# Altium project DCDC Buck Controller.PrjPcb
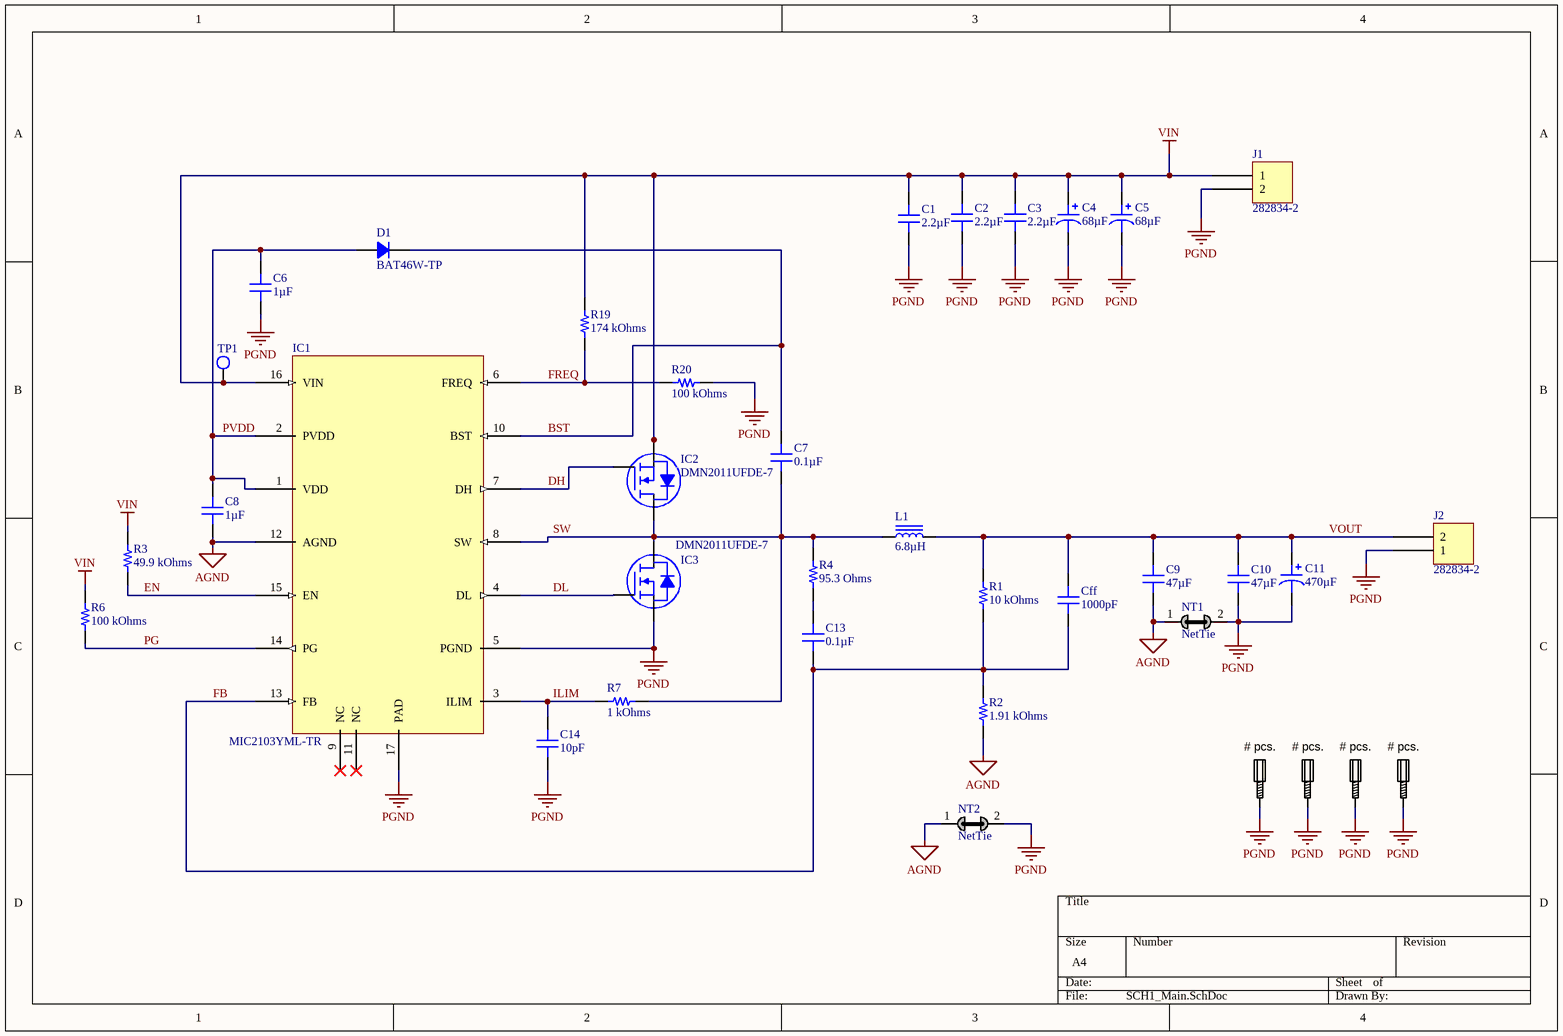
[diagram p0: SCH1_Main.SchDoc]
1 sheet, 36 parts. Net scope: global (net labels, ports and power ports of the same name join across sheets).
Board file: PCB1_DCDC_Controller.PcbDoc

## Sheet SCH1_Main.SchDoc
size A4

### Parts
C1  2.2µF  [CAP 0805_2012]
C2  2.2µF  [CAP 0805_2012]
C3  2.2µF  [CAP 0805_2012]
C4  68µF  [CAP ALSMD 6.6MM H6.1MM]
C5  68µF  [CAP ALSMD 6.6MM H6.1MM]
C6  1µF  [CAP 0805_2012]
C7  0.1µF  [CAP 0805_2012]
C8  1µF  [CAP 0805_2012]
C9  47µF  [CAP 1210_3225 - 2.8MM]
C10  47µF  [CAP 1210_3225 - 2.8MM]
C11  470µF  [CAP ALSMD 6.6MM H8.0MM]
C13  0.1µF  [CAP 0805_2012]
C14  10pF  [CAP 0805_2012]
Cff  1000pF  [CAP 0805_2012]
D1  BAT46W-TP  [SOD-123]
IC1  MIC2103YML-TR  [MLF-16_ML_4X4_00]
IC2  DMN2011UFDE-7  [DIODES U-DFN2020-6E]
IC3  DMN2011UFDE-7  [DIODES U-DFN2020-6E]
J1  282834-2  [TE 282834-2]
J2  282834-2  [TE 282834-2]
L1  6.8µH  [BOURNS SRR1280]
MECH1  # pcs.  [PCB_standoff]
MECH2  # pcs.  [PCB_standoff]
MECH3  # pcs.  [PCB_standoff]
MECH4  # pcs.  [PCB_standoff]
NT1  NetTie  [NetTie_Narrow2]  (net tie, no BOM)
NT2  NetTie  [NetTie_Narrow2]  (net tie, no BOM)
R1  10 kOhms  [RES 0805_2012]
R2  1.91 kOhms  [RES 0805_2012]
R3  49.9 kOhms  [RES 0805_2012]
R4  95.3 Ohms  [RES 0805_2012]
R6  100 kOhms  [RES 0805_2012]
R7  1 kOhms  [RES 0805_2012]
R19  174 kOhms  [RES 0805_2012]
R20  100 kOhms  [RES 0805_2012]
TP1  Test Point  [TestPoint-1.5mm]  (value not drawn)  (no BOM)

### Nets
AGND: C8.1 C9.1 IC1.12(AGND) NT1.1 NT2.1 R2.1
PGND: C1.1 C2.1 C3.1 C4.2 C5.2 C6.1 C10.1 C11.2 C14.1 IC1.5(PGND) IC1.17(PAD) IC3.S J1.2 J2.1 MECH1.MH1 MECH2.MH1 MECH3.MH1 MECH4.MH1 NT1.2 NT2.2 R20.1
VIN: C1.2 C2.2 C3.2 C4.1 C5.1 IC1.16(VIN) IC2.S J1.1 R3.2 R6.2 R19.2 TP1.1(TP)
BST: C7.2 D1.2 IC1.10(BST)
DH: IC1.7(DH) IC2.G
DL: IC1.4(DL) IC3.G
EN: IC1.15(EN) R3.1
FB: C13.1 Cff.1 IC1.13(FB) R1.1 R2.2
FREQ: IC1.6(FREQ) R19.1 R20.2
ILIM: C14.2 IC1.3(ILIM) R7.1
PG: IC1.14(PG) R6.1
PVDD: C6.2 C8.2 D1.1 IC1.1(VDD) IC1.2(PVDD)
SW: C7.1 IC1.8(SW) IC2.D(Drain) IC3.D(Drain) L1.1 R4.2 R7.2
VOUT: C9.2 C10.2 C11.1 Cff.2 J2.2 L1.2 R1.2
NetC13_2: C13.2 R4.1

Not connected (* = marked no-connect by the designer): IC1 9(NC)* 11(NC)*

### Library data of the parts
C1-C3 = 08053C225K4Z2A: CAP CER 2.2UF 25V X7R 0805; Manufacturer: AVX Corporation; Tolerance: ±10%; Part Number: 08053C225K4Z2A; Value: 2.2µF; Applications: Automotive, Boardflex Sensitive; Capacitance: 2.2µF; ComponentLink1Description: Datasheet; ComponentLink1URL: http://datasheets.avx.com/AutoMLCC.pdf; ComponentLink2Description: DigiKey Link; ComponentLink2URL: http://digikey.com/product-detail/en/avx-corporation/08053C225K4Z2A/478-12141-1-ND/9374710; Device Package: 0805 (2012 Metric); Features: Soft Termination; LastUpdated: 1/21/2020 12:02:42 AM; Lifecycle Status: Active; Minimum Order: 1; Mounting Type: Surface Mount, MLCC; Operating Temperature: -55°C ~ 125°C; Package / Case: 0805 (2012 Metric); Packaging: TapeAndReel; PartId: 16604; Part Status: Active; Price: 0.08; Ratings: AEC-Q200; Series: FLEXITERM®; Size / Dimension: 0.079" L x 0.049" W (2.01mm x 1.25mm); Supplier 1: DigiKey; Supplier Part Number 1: 478-12141-1-ND; Temperature Coefficient: X7R; Voltage - Rated: 25V
C4 C5 = UWD1E680MCL1GS: CAP ALUM 68UF 20% 25V SMD; Manufacturer: Nichicon; Impedance: 440 mOhms; Lifetime @ Temp.: 2000 Hrs @ 105°C; Ripple Current @ High Frequency: 230mA @ 100kHz; Ripple Current @ Low Frequency: 115mA @ 120Hz; Surface Mount Land Size: 0.260" L x 0.260" W (6.60mm x 6.60mm); Part Number: UWD1E680MCL1GS; Applications: General Purpose; Capacitance: 68µF; ComponentLink1Description: Datasheet; ComponentLink1URL: http://nichicon-us.com/english/products/pdfs/e-uwd.pdf; ComponentLink2Description: DigiKey Link; ComponentLink2URL: http://digikey.com/product-detail/en/nichicon/UWD1E680MCL1GS/493-9673-1-ND/3963005; Device Package: Radial, Can - SMD; Height - Seated (Max): 0.228" (5.80mm); LastUpdated: 1/21/2020 2:33:32 AM; Lifecycle Status: Active; Minimum Order: 1; Mounting Type: Surface Mount; Operating Temperature: -55°C ~ 105°C; Package / Case: Radial, Can - SMD; Packaging: TapeAndReel; PartId: 8861; Part Status: Active; Price: 0.22; Series: UWD; Size / Dimension: 0.248" Dia (6.30mm); Supplier 1: DigiKey; Supplier Part Number 1: 493-9673-1-ND; Tolerance: ±20%; Value: 68µF; Voltage - Rated: 25V
C6 C8 = CC0805KKX5R8BB105: CAP CER 1UF 25V X5R 0805; Manufacturer: Yageo; Tolerance: ±10%; Part Number: CC0805KKX5R8BB105; Value: 1µF; Applications: General Purpose; Capacitance: 1µF; ComponentLink1Description: Datasheet; ComponentLink1URL: https://www.yageo.com/upload/media/product/productsearch/datasheet/mlcc/UPY-GPHC_X5R_4V-to-50V_25.pdf; ComponentLink2Description: DigiKey Link; ComponentLink2URL: http://digikey.com/product-detail/en/yageo/CC0805KKX5R8BB105/311-1868-1-ND/5195770; Device Package: 0805 (2012 Metric); LastUpdated: 1/21/2020 12:03:00 AM; Lifecycle Status: Active; Minimum Order: 1; Mounting Type: Surface Mount, MLCC; Operating Temperature: -55°C ~ 85°C; Package / Case: 0805 (2012 Metric); Packaging: TapeAndReel; PartId: 6721; Part Status: Active; Price: 0.04; Series: CC; Size / Dimension: 0.079" L x 0.049" W (2.00mm x 1.25mm); Supplier 1: DigiKey; Supplier Part Number 1: 311-1868-1-ND; Temperature Coefficient: X5R; Thickness (Max): 0.057" (1.45mm); Voltage - Rated: 25V
C7 C13 = CL21B104KBFNNNE: CAP CER 0.1UF 50V X7R 0805; Manufacturer: Samsung Electro-Mechanics; Tolerance: ±10%; Part Number: CL21B104KBFNNNE; Value: 0.1µF; Applications: General Purpose; Capacitance: 0.1µF; ComponentLink1Description: Datasheet; ComponentLink1URL: http://www.samsungsem.com/kr/support/product-search/mlcc/CL21B104KBFNNNE.jsp; ComponentLink2Description: DigiKey Link; ComponentLink2URL: http://digikey.com/product-detail/en/samsung-electro-mechanics/CL21B104KBFNNNE/1276-1180-1-ND/3889266; Device Package: 0805 (2012 Metric); LastUpdated: 1/21/2020 12:03:00 AM; Lifecycle Status: Active; Minimum Order: 1; Mounting Type: Surface Mount, MLCC; Operating Temperature: -55°C ~ 125°C; Package / Case: 0805 (2012 Metric); Packaging: TapeAndReel; PartId: 6348; Part Status: Active; Price: 0.01; Series: CL; Size / Dimension: 0.079" L x 0.049" W (2.00mm x 1.25mm); Supplier 1: DigiKey; Supplier Part Number 1: 1276-1180-1-ND; Temperature Coefficient: X7R; Thickness (Max): 0.053" (1.35mm); Voltage - Rated: 50V
C9 C10 = GRM32ED71A476KE15L: CAP CER 47UF 10V X7T 1210; Manufacturer: Murata Electronics; Tolerance: ±10%; Part Number: GRM32ED71A476KE15L; Value: 47µF; Applications: General Purpose; Capacitance: 47µF; ComponentLink1Description: Datasheet; ComponentLink1URL: https://search.murata.co.jp/Ceramy/image/img/A01X/G101/ENG/GRM32ED71A476KE15-01.pdf; ComponentLink2Description: DigiKey Link; ComponentLink2URL: http://digikey.com/product-detail/en/murata-electronics/GRM32ED71A476KE15L/490-10532-1-ND/5026471; Device Package: 1210 (3225 Metric); LastUpdated: 8/13/2020 10:37:41 AM; Lifecycle Status: Active; Minimum Order: 1; Mounting Type: Surface Mount, MLCC; Operating Temperature: -55°C ~ 125°C; Package / Case: 1210 (3225 Metric); Packaging: TapeAndReel; PartId: 23810; Part Status: Active; Price: 0.36; Series: GRM; Size / Dimension: 0.126" L x 0.098" W (3.20mm x 2.50mm); Supplier 1: DigiKey; Supplier Part Number 1: 490-10532-1-ND; Temperature Coefficient: X7T; Thickness (Max): 0.106" (2.70mm)
C11 = EMZR100ARA471MF80G: CAP ALUM 470UF 20% 10V SMD; Manufacturer: United Chemi-Con; ESR (Equivalent Series Resistance): 160 mohm @ 100kHz; Lifetime @ Temp.: 2000 Hrs @ 105°C; Polarization: Polar; Ripple Current @ High Frequency: 600mA @ 100kHz; Ripple Current @ Low Frequency: 300mA @ 120Hz; Surface Mount Land Size: 0.260" L x 0.260" W (6.60mm x 6.60mm); Part Number: EMZR100ARA471MF80G; Applications: Automotive; Capacitance: 470µF; ComponentLink1Description: Datasheet; ComponentLink1URL: http://www.chemi-con.co.jp/cgi-bin/CAT_DB/SEARCH/cat_db_al.cgi?e=e&j=p&pdfname=mzr; ComponentLink2Description: DigiKey Link; ComponentLink2URL: http://digikey.com/product-detail/en/united-chemi-con/EMZR100ARA471MF80G/565-5133-1-ND/8637128; Device Package: Radial, Can - SMD; Height - Seated (Max): 0.315" (8.00mm); LastUpdated: 1/21/2020 4:06:45 AM; Lifecycle Status: Active; Minimum Order: 1; Mounting Type: Surface Mount; Operating Temperature: -55°C ~ 105°C; Package / Case: Radial, Can - SMD; Packaging: TapeAndReel; PartId: 8433; Part Status: Active; Price: 0.20; Ratings: AEC-Q200; Series: Alchip™- MZR; Size / Dimension: 0.248" Dia (6.30mm); Supplier 1: DigiKey; Supplier Part Number 1: 565-5133-1-ND; Tolerance: ±20%; Value: 470µF; Voltage - Rated: 10V
C14 = C0805C100J5GACTU: CAP CER 10PF 50V C0G/NP0 0805; Manufacturer: KEMET; Temperature Coefficient: C0G, NP0; Tolerance: ±5%; Part Number: C0805C100J5GACTU; Value: 10pF; Applications: General Purpose; Capacitance: 10pF; ComponentLink1Description: Datasheet; ComponentLink1URL: https://api.kemet.com/component-edge/download/datasheet/C0805C100J5GACTU.pdf; ComponentLink2Description: DigiKey Link; ComponentLink2URL: http://digikey.com/product-detail/en/kemet/C0805C100J5GACTU/399-1108-1-ND/411383; Device Package: 0805 (2012 Metric); Features: Low ESL; LastUpdated: 1/21/2020 12:02:51 AM; Lifecycle Status: Active; Minimum Order: 1; Mounting Type: Surface Mount, MLCC; Operating Temperature: -55°C ~ 125°C; Package / Case: 0805 (2012 Metric); Packaging: TapeAndReel; PartId: 12731; Part Status: Active; Price: 0.02; Series: SMD Comm C0G; Size / Dimension: 0.079" L x 0.049" W (2.00mm x 1.25mm); Supplier 1: DigiKey; Supplier Part Number 1: 399-1108-1-ND; Thickness (Max): 0.035" (0.88mm); Voltage - Rated: 50V
Cff = CC0805GRNPO9BN102: CAP CER 1000PF 50V NPO 0805; Manufacturer: Yageo; Temperature Coefficient: C0G, NP0; Tolerance: ±2%; Part Number: CC0805GRNPO9BN102; Value: 1000pF; Applications: General Purpose; Capacitance: 1000pF; ComponentLink1Description: Datasheet; ComponentLink1URL: https://www.yageo.com/upload/media/product/productsearch/datasheet/mlcc/UPY-GP_NP0_16V-to-50V_17.pdf; ComponentLink2Description: DigiKey Link; ComponentLink2URL: http://digikey.com/product-detail/en/yageo/CC0805GRNPO9BN102/311-4189-1-ND/8025278; Device Package: 0805 (2012 Metric); LastUpdated: 1/21/2020 12:02:57 AM; Lifecycle Status: Active; Minimum Order: 1; Mounting Type: Surface Mount, MLCC; Operating Temperature: -55°C ~ 125°C; Package / Case: 0805 (2012 Metric); Packaging: TapeAndReel; PartId: 8594; Part Status: Active; Price: 0.03; Series: CC; Size / Dimension: 0.079" L x 0.049" W (2.00mm x 1.25mm); Supplier 1: DigiKey; Supplier Part Number 1: 311-4189-1-ND; Thickness (Max): 0.028" (0.70mm); Voltage - Rated: 50V
D1 = BAT46W-TP: DIODE SCHOTTKY 100V 75MA SOD123; Manufacturer: Micro Commercial Co; Capacitance @ Vr, F: 10pF @ 0V, 1MHz; Current - Reverse Leakage @ Vr: 5µA @ 75V; Speed: Small Signal =< 200mA (Io), Any Speed; Voltage - Forward (Vf) (Max) @ If: 450mV @ 10mA; Part Number: BAT46W-TP; ComponentLink1Description: Datasheet; ComponentLink1URL: https://www.mccsemi.com/pdf/Products/BAT46W(SOD-123).pdf; ComponentLink2Description: DigiKey Link; ComponentLink2URL: http://digikey.com/product-detail/en/micro-commercial-co/BAT46W-TP/BAT46W-TPMSCT-ND/2345686; Current - Average Rectified (Io): 75mA; Device Package: SOD-123; Diode Type: Schottky; LastUpdated: 1/21/2020 2:42:33 AM; Lifecycle Status: Active; Minimum Order: 1; Mounting Type: Surface Mount; Operating Temperature - Junction: -55°C ~ 125°C; Package / Case: SOD-123; Packaging: TapeAndReel; PartId: 2322; Part Status: Active; Price: 0.05; Series: -; Supplier 1: DigiKey; Supplier Part Number 1: BAT46W-TPMSCT-ND; Supplier Device Package: SOD-123; Voltage - DC Reverse (Vr) (Max): 100V
IC1 = MIC2103YML-TR: IC REG CTRLR BUCK 16MLF; Vendor: Microchip; Built_By: EMA_Jessica; SourceLibrary: Microchip_2019-08-23_2; Manufacturer_Part_Number: MIC2103YML-TR; Copyright: Copyright (C) 2018 Accelerated Designs. All rights reserved; RefDes: RefDes; Type: DEV; Supplier 1: Digi-Key; Supplier Part Number 1: 576-4156-1-ND; Manufacturer: Microchip; Manufacturer Part Number: MIC2103YML-TR; RoHS: Yes; Category: Voltage Regulators - Switching; Stock 1: 4575; Pricing 1: 1=1.38000, 25=1.15000, 100=1.05000 (USD); ComponentLink1URL: http://components.arrow.com/part/dataview/56727868S414286N1374?src-supplier=Arrow; ComponentLink1Description: http://components.arrow.com/part/dataview/56727868S414286N1374?src-supplier=Arrow; ComponentLink2URL: http://components.arrow.com/part/dataview/0323_06358916?src-supplier=Arrow+Europe; ComponentLink2Description: http://components.arrow.com/part/dataview/0323_06358916?src-supplier=Arrow+Europe; ComponentLink3URL: http://www.microchip.com/mymicrochip/filehandler.aspx?ddocname=en579526&src-supplier=Digi-Key; ComponentLink3Description: http://www.microchip.com/mymicrochip/filehandler.aspx?ddocname=en579526&src-supplier=Digi-Key; ComponentLink4URL: http://www.micrel.com/_PDF/MIC2103_4.pdf?src-supplier=Mouser; ComponentLink4Description: http://www.micrel.com/_PDF/MIC2103_4.pdf?src-supplier=Mouser
IC2 IC3 = DMN2011UFDE-7: MOSFET N-CH 20V 11.7A UDFN2020-6; Manufacturer: Diodes Incorporated; Current - Continuous Drain (Id) @ 25°C: 11.7A (Ta); Drive Voltage (Max Rds On,  Min Rds On): 1.5V, 4.5V; FET Type: N-Channel; Gate Charge (Qg) (Max) @ Vgs: 56nC @ 10V; Input Capacitance (Ciss) (Max) @ Vds: 2248pF @ 10V; Power Dissipation (Max): 610mW (Ta); Rds On (Max) @ Id, Vgs: 9.5mOhm @ 7A, 4.5V; Vgs (Max): ±12V; Vgs(th) (Max) @ Id: 1V @ 250µA; Part Number: DMN2011UFDE-7; ComponentLink1Description: Datasheet; ComponentLink1URL: https://www.diodes.com/assets/Datasheets/DMN2011UFDE.pdf; ComponentLink2Description: DigiKey Link; ComponentLink2URL: http://digikey.com/product-detail/en/diodes-incorporated/DMN2011UFDE-7/DMN2011UFDE-7DICT-ND/4810946; Device Package: 6-UDFN Exposed Pad; Drain to Source Voltage (Vdss): 20V; LastUpdated: 3/30/2020 1:01:59 PM; Lifecycle Status: Active; Minimum Order: 1; Mounting Type: Surface Mount; Operating Temperature: -55°C ~ 150°C (TJ); Package / Case: 6-UDFN Exposed Pad; Packaging: TapeAndReel; Part Status: Active; Price: 0.24; Series: -; Supplier 1: DigiKey; Supplier Part Number 1: DMN2011UFDE-7DICT-ND; Supplier Device Package: U-DFN2020-6 (Type E); Technology: MOSFET (Metal Oxide)
J1 J2 = 282834-2: TERM BLK 2P SIDE ENT 2.54MM PCB; Manufacturer: TE Connectivity AMP Connectors; Current: 10A; Mating Orientation: Horizontal with Board; Number of Levels: 1; Pitch: 0.100" (2.54mm); Positions Per Level: 2; Voltage: 150V; Wire Gauge: 16-30 AWG; Wire Termination: Screw - Rising Cage Clamp; Part Number: 282834-2; Color: Green; ComponentLink1Description: Datasheet; ComponentLink1URL: https://www.te.com/commerce/DocumentDelivery/DDEController?Action=srchrtrv&DocNm=282834&DocType=Customer+Drawing&DocLang=English; ComponentLink2Description: DigiKey Link; ComponentLink2URL: http://digikey.com/product-detail/en/te-connectivity-amp-connectors/282834-2/A98333-ND/1150135; LastUpdated: 1/15/2020 4:15:38 AM; Lifecycle Status: Active; Minimum Order: 1; Mounting Type: Through Hole; Packaging: Bulk; Part Status: Active; Price: 0.88; Series: Buchanan; Supplier 1: DigiKey; Supplier Part Number 1: A98333-ND
L1 = SRR1280-6R8Y: FIXED IND 6.8UH 7.6A 18.5MOHM SM; Manufacturer: Bourns Inc.; Current - Saturation: 8A; DC Resistance (DCR): 18.5mOhm Max; Frequency - Self Resonant: 22MHz; Inductance Frequency - Test: 100kHz; Material - Core: Ferrite; Q @ Freq: 20 @ 7.96MHz; Shielding: Shielded; Tolerance: ±30%; Type: Wirewound; Part Number: SRR1280-6R8Y; ComponentLink1Description: Datasheet; ComponentLink1URL: https://www.bourns.com/docs/Product-Datasheets/SRR1280.pdf; ComponentLink2Description: DigiKey Link; ComponentLink2URL: http://digikey.com/product-detail/en/bourns-inc/SRR1280-6R8Y/SRR1280-6R8YCT-ND/3986771; Current Rating (Amps): 7.6A; Device Package: Nonstandard; Height - Seated (Max): 0.315" (8.00mm); Inductance: 6.8µH; LastUpdated: 1/21/2020 3:25:29 AM; Lifecycle Status: Active; Minimum Order: 1; Mounting Type: Surface Mount; Operating Temperature: -40°C ~ 125°C; Package / Case: Nonstandard; Packaging: TapeAndReel; PartId: 41; Part Status: Active; Price: 0.65; Series: SRR1280; Size / Dimension: 0.492" L x 0.492" W (12.50mm x 12.50mm); Supplier 1: DigiKey; Supplier Part Number 1: SRR1280-6R8YCT-ND; Value: 6.8µH
MECH1-MECH4 = STANDOFF_M-F_THREADED_M3x8x10mm_HEX_5mm dia: STANDOFF M/F MET 5MM HEX 10MM L; Manufacturer 1: Keystone Electronics; Manufacturer Part Number 1: 24313; Thread/Screw/Hole Size: M3 Thread; Plating: Nickel; Between Board Height: 0.394" (10.0mm); SCDType: undef; RoHS: RoHS Compliant; Description 1: STANDOFF M/F MET 5MM HEX 10MM L; Category: Hardware Fasteners Accessories; Stock 1: 240; Pricing 1: 10=0.969, 100=0.881, 500=0.58, 1000=0.3685, 2500=0.34215 (USD); Type: Hex Threaded, Male/Female; Size: 0.197" (5.0mm) Hex; Length - Overall: 0.709" (18.0mm); Material: Brass; Color: Natural; ComponentLink1URL: http://www.keyelco.com/pdfs/M55p67.pdf; ComponentLink1Description: http://www.keyelco.com/pdfs/M55p67.pdf; Supplier 1: Digi-Key; Supplier Part Number 1: 24313K-ND
R1 = CRS0805-FX-1002ELF: RES SMD 10K OHM 1% 1/4W 0805; Manufacturer: Bourns Inc.; Power (Watts): 0.25W, 1/4W; Temperature Coefficient: ±100ppm/°C; Part Number: CRS0805-FX-1002ELF; Value: 10 kOhms; ComponentLink1Description: Datasheet; ComponentLink1URL: https://www.bourns.com/data/global/pdfs/CRS.pdf; ComponentLink2Description: DigiKey Link; ComponentLink2URL: http://digikey.com/product-detail/en/bourns-inc/CRS0805-FX-1002ELF/CRS0805-FX-1002ELFCT-ND/5778744; Composition: Thick Film; Device Package: 0805 (2012 Metric); Features: High Voltage, Pulse Withstanding; Height - Seated (Max): 0.024" (0.60mm); LastUpdated: 1/21/2020 1:39:12 AM; Lifecycle Status: Active; Minimum Order: 1; Number of Terminations: 2; Operating Temperature: -55°C ~ 155°C; Package / Case: 0805 (2012 Metric); Packaging: TapeAndReel; PartId: 49386; Part Status: Active; Price: 0.04; Resistance: 10 kOhms; Series: CRS; Size / Dimension: 0.079" L x 0.049" W (2.00mm x 1.25mm); Supplier 1: DigiKey; Supplier Part Number 1: CRS0805-FX-1002ELFCT-ND; Supplier Device Package: 0805; Tolerance: ±1%
R2 = RT0805BRD071K91L: RES SMD 1.91K OHM 0.1% 1/8W 0805; Manufacturer: Yageo; Power (Watts): 0.125W, 1/8W; Temperature Coefficient: ±25ppm/°C; Part Number: RT0805BRD071K91L; Value: 1.91 kOhms; ComponentLink1Description: Datasheet; ComponentLink1URL: https://www.yageo.com/upload/media/product/productsearch/datasheet/rchip/PYu-RT_1-to-0.01_RoHS_L_11.pdf; ComponentLink2Description: DigiKey Link; ComponentLink2URL: http://digikey.com/product-detail/en/yageo/RT0805BRD071K91L/YAG4852CT-ND/6617008; Composition: Thin Film; Device Package: 0805 (2012 Metric); Height - Seated (Max): 0.024" (0.60mm); LastUpdated: 1/21/2020 1:44:20 AM; Lifecycle Status: Active; Minimum Order: 1; Number of Terminations: 2; Operating Temperature: -55°C ~ 155°C; Package / Case: 0805 (2012 Metric); Packaging: TapeAndReel; PartId: 40717; Part Status: Active; Price: 0.05; Resistance: 1.91 kOhms; Series: RT; Size / Dimension: 0.079" L x 0.049" W (2.00mm x 1.25mm); Supplier 1: DigiKey; Supplier Part Number 1: YAG4852CT-ND; Supplier Device Package: 0805; Tolerance: ±0.1%
R3 = CRCW080549K9FKEAC: RES SMD 49.9K OHM 1% 1/8W 0805; Manufacturer: Vishay Dale; Power (Watts): 0.125W, 1/8W; Temperature Coefficient: ±100ppm/°C; Part Number: CRCW080549K9FKEAC; Value: 49.9 kOhms; ComponentLink1Description: Datasheet; ComponentLink1URL: http://www.vishay.com/docs/28773/crcwce3.pdf; ComponentLink2Description: DigiKey Link; ComponentLink2URL: http://digikey.com/product-detail/en/vishay-dale/CRCW080549K9FKEAC/541-4141-1-ND/7928824; Composition: Thick Film; Device Package: 0805 (2012 Metric); Height - Seated (Max): 0.024" (0.60mm); LastUpdated: 1/21/2020 1:41:53 AM; Lifecycle Status: Active; Minimum Order: 1; Number of Terminations: 2; Operating Temperature: -55°C ~ 155°C; Package / Case: 0805 (2012 Metric); Packaging: TapeAndReel; PartId: 46246; Part Status: Active; Price: 0.01; Resistance: 49.9 kOhms; Series: CRCW-C; Size / Dimension: 0.079" L x 0.049" W (2.00mm x 1.25mm); Supplier 1: DigiKey; Supplier Part Number 1: 541-4141-1-ND; Supplier Device Package: 0805; Tolerance: ±1%
R4 = ERA-6AEB95R3V: RES 95.3 OHM 0.1% 1/8W 0805; Manufacturer: Panasonic Electronic Components; Power (Watts): 0.125W, 1/8W; Temperature Coefficient: ±25ppm/°C; Part Number: ERA-6AEB95R3V; Value: 95.3 Ohms; ComponentLink1Description: Datasheet; ComponentLink1URL: https://industrial.panasonic.com/cdbs/www-data/pdf/RDM0000/AOA0000C307.pdf; ComponentLink2Description: DigiKey Link; ComponentLink2URL: http://digikey.com/product-detail/en/panasonic-electronic-components/ERA-6AEB95R3V/P95.3DACT-ND/3075294; Composition: Thin Film; Device Package: 0805 (2012 Metric); Features: Automotive AEC-Q200; Height - Seated (Max): 0.024" (0.60mm); LastUpdated: 1/21/2020 1:48:33 AM; Lifecycle Status: Active; Minimum Order: 1; Number of Terminations: 2; Operating Temperature: -55°C ~ 155°C; Package / Case: 0805 (2012 Metric); Packaging: TapeAndReel; PartId: 31156; Part Status: Active; Price: 0.04; Ratings: AEC-Q200; Resistance: 95.3 Ohms; Series: ERA-6A; Size / Dimension: 0.079" L x 0.049" W (2.00mm x 1.25mm); Supplier 1: DigiKey; Supplier Part Number 1: P95.3DACT-ND; Supplier Device Package: 0805; Tolerance: ±0.1%
R6 R20 = ERJ-6GEYJ104V: RES SMD 100K OHM 5% 1/8W 0805; Manufacturer: Panasonic Electronic Components; Power (Watts): 0.125W, 1/8W; Temperature Coefficient: ±200ppm/°C; Part Number: ERJ-6GEYJ104V; Value: 100 kOhms; ComponentLink1Description: Datasheet; ComponentLink1URL: http://industrial.panasonic.com/www-cgi/jvcr13pz.cgi?E+PZ+3+AOA0001+ERJ6GEYJ104V+7+WW; ComponentLink2Description: DigiKey Link; ComponentLink2URL: http://digikey.com/product-detail/en/panasonic-electronic-components/ERJ-6GEYJ104V/P100KACT-ND/692; Composition: Thick Film; Device Package: 0805 (2012 Metric); Features: Automotive AEC-Q200; Height - Seated (Max): 0.028" (0.70mm); LastUpdated: 1/21/2020 1:39:37 AM; Lifecycle Status: Active; Minimum Order: 1; Number of Terminations: 2; Operating Temperature: -55°C ~ 155°C; Package / Case: 0805 (2012 Metric); Packaging: TapeAndReel; PartId: 48780; Part Status: Active; Price: 0.01; Ratings: AEC-Q200; Resistance: 100 kOhms; Series: ERJ; Size / Dimension: 0.079" L x 0.049" W (2.00mm x 1.25mm); Supplier 1: DigiKey; Supplier Part Number 1: P100KACT-ND; Supplier Device Package: 0805; Tolerance: ±5%
R7 = RT0805DRD071KL: RES SMD 1K OHM 0.5% 1/8W 0805; Manufacturer: Yageo; Power (Watts): 0.125W, 1/8W; Temperature Coefficient: ±25ppm/°C; Part Number: RT0805DRD071KL; Value: 1 kOhms; ComponentLink1Description: Datasheet; ComponentLink1URL: https://www.yageo.com/upload/media/product/productsearch/datasheet/rchip/PYu-RT_1-to-0.01_RoHS_L_11.pdf; ComponentLink2Description: DigiKey Link; ComponentLink2URL: http://digikey.com/product-detail/en/yageo/RT0805DRD071KL/311-2717-1-ND/6129136; Composition: Thin Film; Device Package: 0805 (2012 Metric); Height - Seated (Max): 0.024" (0.60mm); LastUpdated: 1/21/2020 1:41:30 AM; Lifecycle Status: Active; Minimum Order: 1; Number of Terminations: 2; Operating Temperature: -55°C ~ 155°C; Package / Case: 0805 (2012 Metric); Packaging: TapeAndReel; PartId: 46687; Part Status: Active; Price: 0.03; Resistance: 1 kOhms; Series: RT; Size / Dimension: 0.079" L x 0.049" W (2.00mm x 1.25mm); Supplier 1: DigiKey; Supplier Part Number 1: 311-2717-1-ND; Supplier Device Package: 0805; Tolerance: ±0.5%
R19 = ERJ-6ENF1743V: RES SMD 174K OHM 1% 1/8W 0805; Manufacturer: Panasonic Electronic Components; Power (Watts): 0.125W, 1/8W; Temperature Coefficient: ±100ppm/°C; Part Number: ERJ-6ENF1743V; Value: 174 kOhms; ComponentLink1Description: Datasheet; ComponentLink1URL: https://industrial.panasonic.com/cdbs/www-data/pdf/RDA0000/AOA0000C304.pdf; ComponentLink2Description: DigiKey Link; ComponentLink2URL: http://digikey.com/product-detail/en/panasonic-electronic-components/ERJ-6ENF1743V/P174KCCT-ND/111154; Composition: Thick Film; Device Package: 0805 (2012 Metric); Features: Automotive AEC-Q200; Height - Seated (Max): 0.028" (0.70mm); LastUpdated: 1/21/2020 1:41:47 AM; Lifecycle Status: Active; Minimum Order: 1; Number of Terminations: 2; Operating Temperature: -55°C ~ 155°C; Package / Case: 0805 (2012 Metric); Packaging: TapeAndReel; PartId: 46286; Part Status: Active; Price: 0.01; Ratings: AEC-Q200; Resistance: 174 kOhms; Series: ERJ; Size / Dimension: 0.079" L x 0.049" W (2.00mm x 1.25mm); Supplier 1: DigiKey; Supplier Part Number 1: P174KCCT-ND; Supplier Device Package: 0805; Tolerance: ±1%